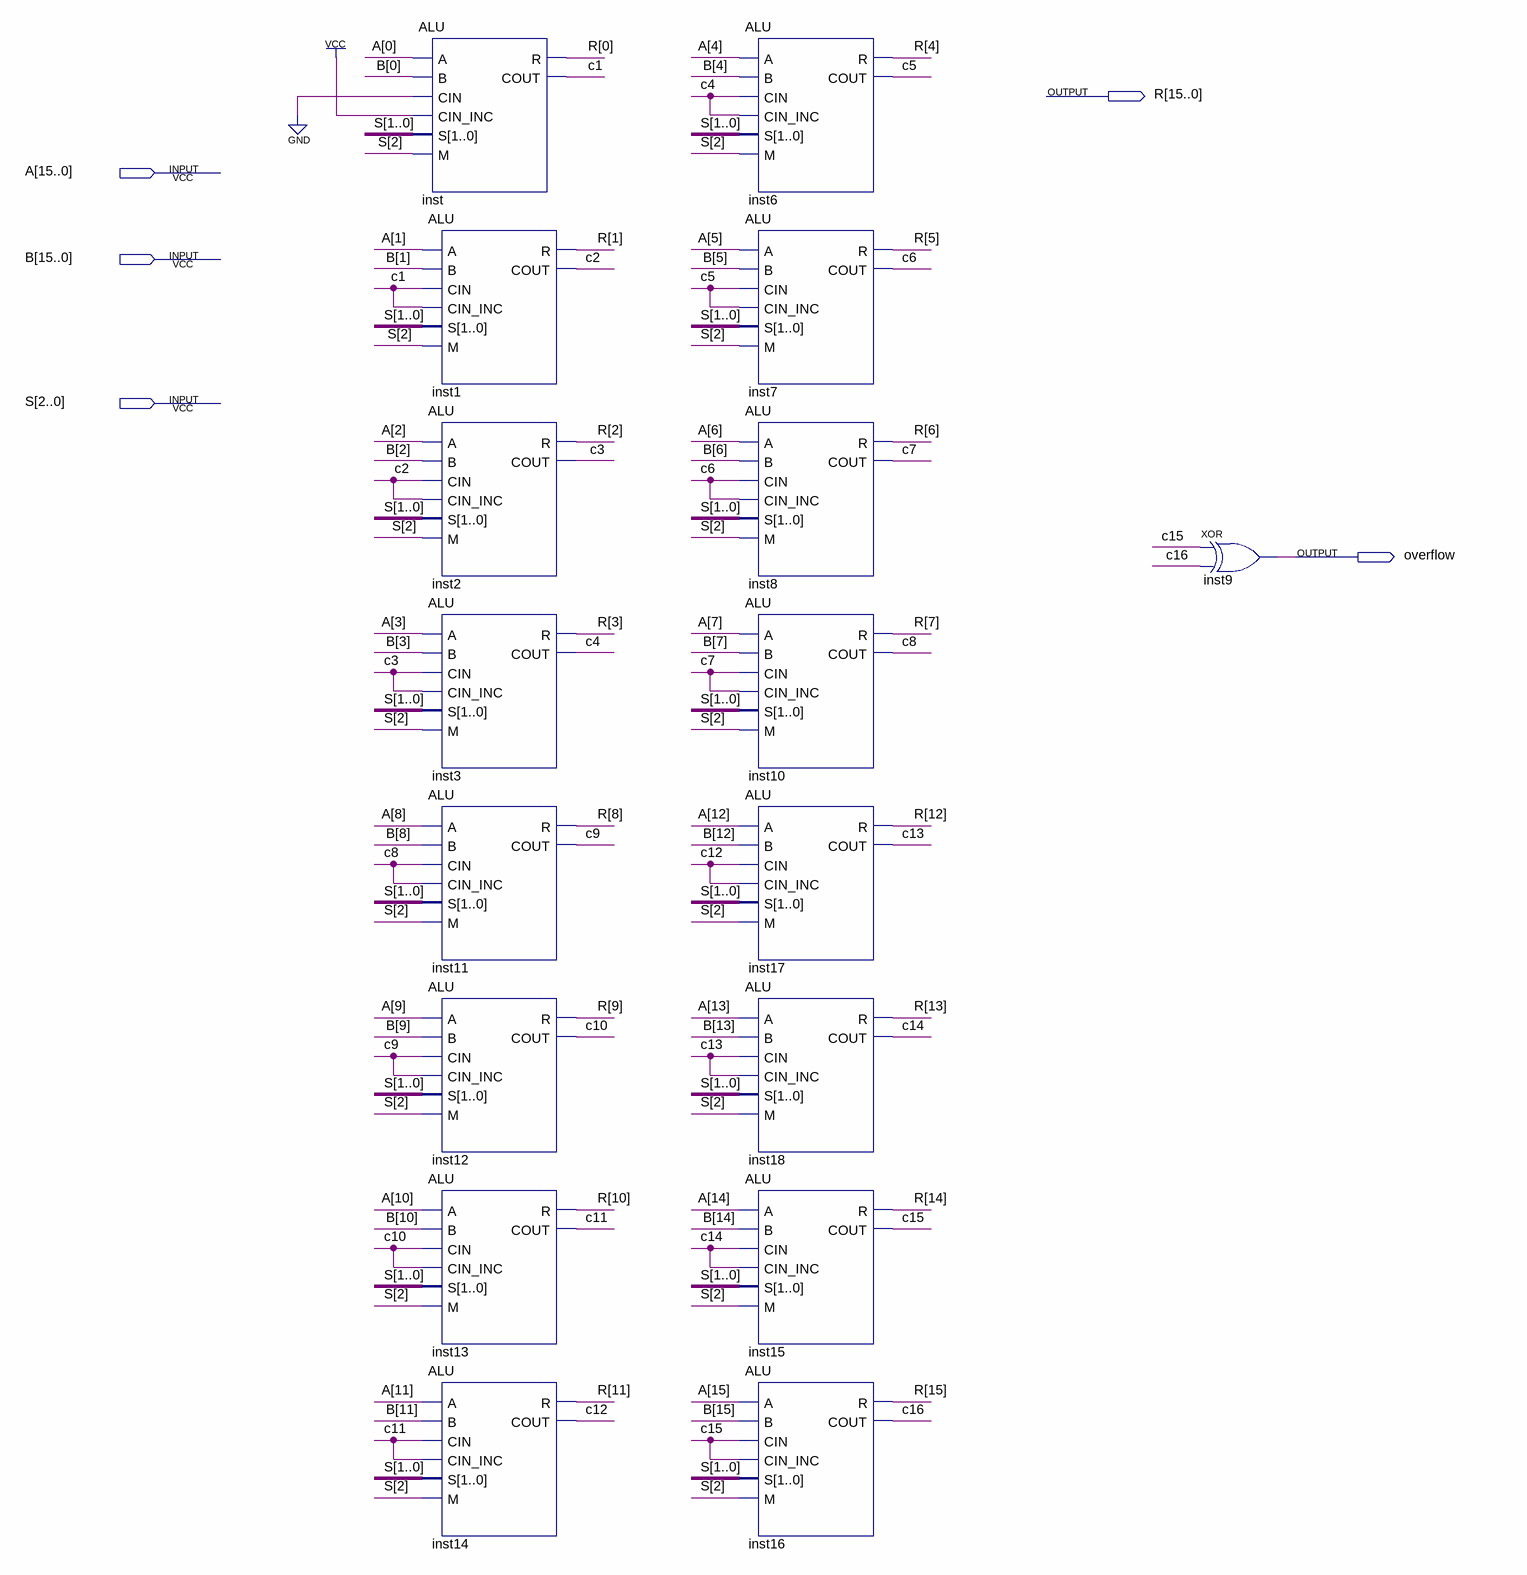
[diagram p0: schematic sheet]
// Quartus schematic ALU_16bit.bdf as structural Verilog: 17 symbols, 5 pins
module ALU_16bit (
  input  [15:0] A,
  input  [15:0] B,
  input  [2:0] S,
  output [15:0] R,
  output overflow
);

  wire c1, c2, c3, c4, c5, c6, c7, c8, c9, c10, c11, c12, c13, c14, c15, c16;

  ALU inst (.A(A[0]), .B(B[0]), .CIN(1'b0), .CIN_INC(1'b1), .S(S[1:0]), .M(S[2]), .R(R[0]), .COUT(c1));
  ALU inst1 (.A(A[1]), .B(B[1]), .CIN(c1), .CIN_INC(c1), .S(S[1:0]), .M(S[2]), .R(R[1]), .COUT(c2));
  ALU inst2 (.A(A[2]), .B(B[2]), .CIN(c2), .CIN_INC(c2), .S(S[1:0]), .M(S[2]), .R(R[2]), .COUT(c3));
  ALU inst3 (.A(A[3]), .B(B[3]), .CIN(c3), .CIN_INC(c3), .S(S[1:0]), .M(S[2]), .R(R[3]), .COUT(c4));
  ALU inst11 (.A(A[8]), .B(B[8]), .CIN(c8), .CIN_INC(c8), .S(S[1:0]), .M(S[2]), .R(R[8]), .COUT(c9));
  ALU inst12 (.A(A[9]), .B(B[9]), .CIN(c9), .CIN_INC(c9), .S(S[1:0]), .M(S[2]), .R(R[9]), .COUT(c10));
  ALU inst13 (.A(A[10]), .B(B[10]), .CIN(c10), .CIN_INC(c10), .S(S[1:0]), .M(S[2]), .R(R[10]), .COUT(c11));
  ALU inst14 (.A(A[11]), .B(B[11]), .CIN(c11), .CIN_INC(c11), .S(S[1:0]), .M(S[2]), .R(R[11]), .COUT(c12));
  ALU inst6 (.A(A[4]), .B(B[4]), .CIN(c4), .CIN_INC(c4), .S(S[1:0]), .M(S[2]), .R(R[4]), .COUT(c5));
  ALU inst7 (.A(A[5]), .B(B[5]), .CIN(c5), .CIN_INC(c5), .S(S[1:0]), .M(S[2]), .R(R[5]), .COUT(c6));
  ALU inst8 (.A(A[6]), .B(B[6]), .CIN(c6), .CIN_INC(c6), .S(S[1:0]), .M(S[2]), .R(R[6]), .COUT(c7));
  ALU inst10 (.A(A[7]), .B(B[7]), .CIN(c7), .CIN_INC(c7), .S(S[1:0]), .M(S[2]), .R(R[7]), .COUT(c8));
  ALU inst17 (.A(A[12]), .B(B[12]), .CIN(c12), .CIN_INC(c12), .S(S[1:0]), .M(S[2]), .R(R[12]), .COUT(c13));
  ALU inst18 (.A(A[13]), .B(B[13]), .CIN(c13), .CIN_INC(c13), .S(S[1:0]), .M(S[2]), .R(R[13]), .COUT(c14));
  ALU inst15 (.A(A[14]), .B(B[14]), .CIN(c14), .CIN_INC(c14), .S(S[1:0]), .M(S[2]), .R(R[14]), .COUT(c15));
  ALU inst16 (.A(A[15]), .B(B[15]), .CIN(c15), .CIN_INC(c15), .S(S[1:0]), .M(S[2]), .R(R[15]), .COUT(c16));
  xor inst9 (overflow, c15, c16);
endmodule
